# Altium schematic sheet 外围电路.SchDoc
size A4
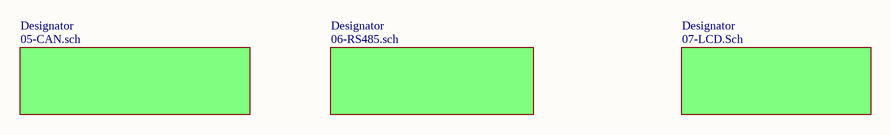
[diagram p0: 外围电路.SchDoc]

## Sub-sheets
Designator = 06-RS485.sch: no entries
Designator = 07-LCD.Sch: no entries
Designator = 05-CAN.sch: no entries